# EAGLE design EnclosureBoard (EAGLE 9.2.2)
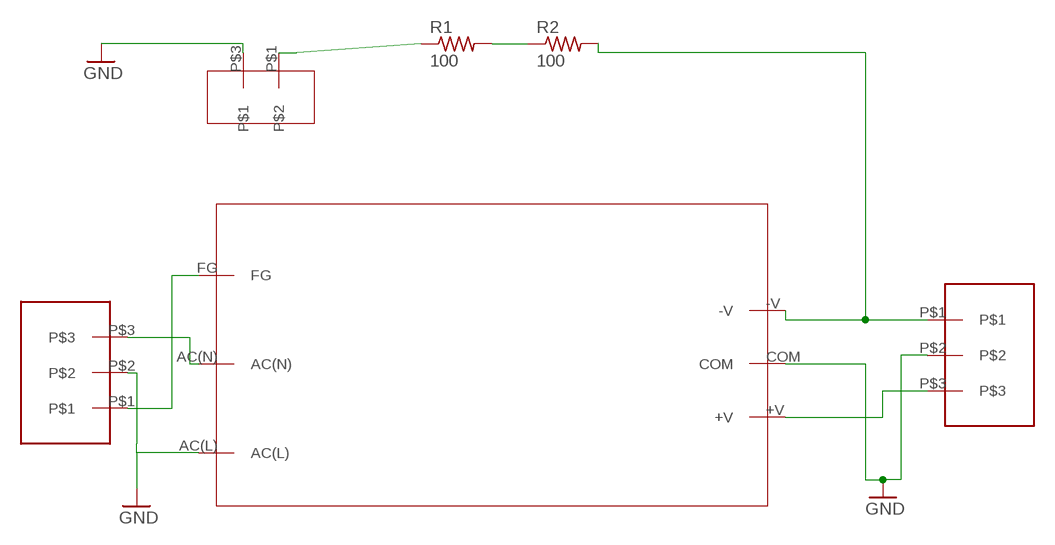
[diagram p0: schematic, sheet 1]

## Parts
R1  100  R-US_0207/10  [0207/10]
R2  100  R-US_0207/10  [0207/10]
U$1  YW1512A-POWER-SUPPLY  [YW1512A]
U$2  AC-POWER-ENTRY  [3POSTERMINAL]
U$3  AC-POWER-ENTRY  [3POSTERMINAL]
U$4  2POSTBLOCK  [2POSTTERMINALBLOCK]

## Nets
GND: U$1.AC(L) U$1.COM U$2.P$2 U$3.P$2 U$4.P$3
N$1: R1.1 U$4.P$1
N$2: R1.2 R2.1
N$3: U$1.FG U$2.P$1
N$5: R2.2 U$1.-V U$3.P$1
N$6: U$1.AC(N) U$2.P$3
N$8: U$1.+V U$3.P$3

## Library data of the parts
R1 R2 = resistor:R-US_: RESISTOR, American symbol
U$1 = PowerSupply:YW1512A-POWER-SUPPLY
U$2 U$3 = Terminal Block:AC-POWER-ENTRY
U$4 = 2PostTerminalBlock:2POSTBLOCK

## Board
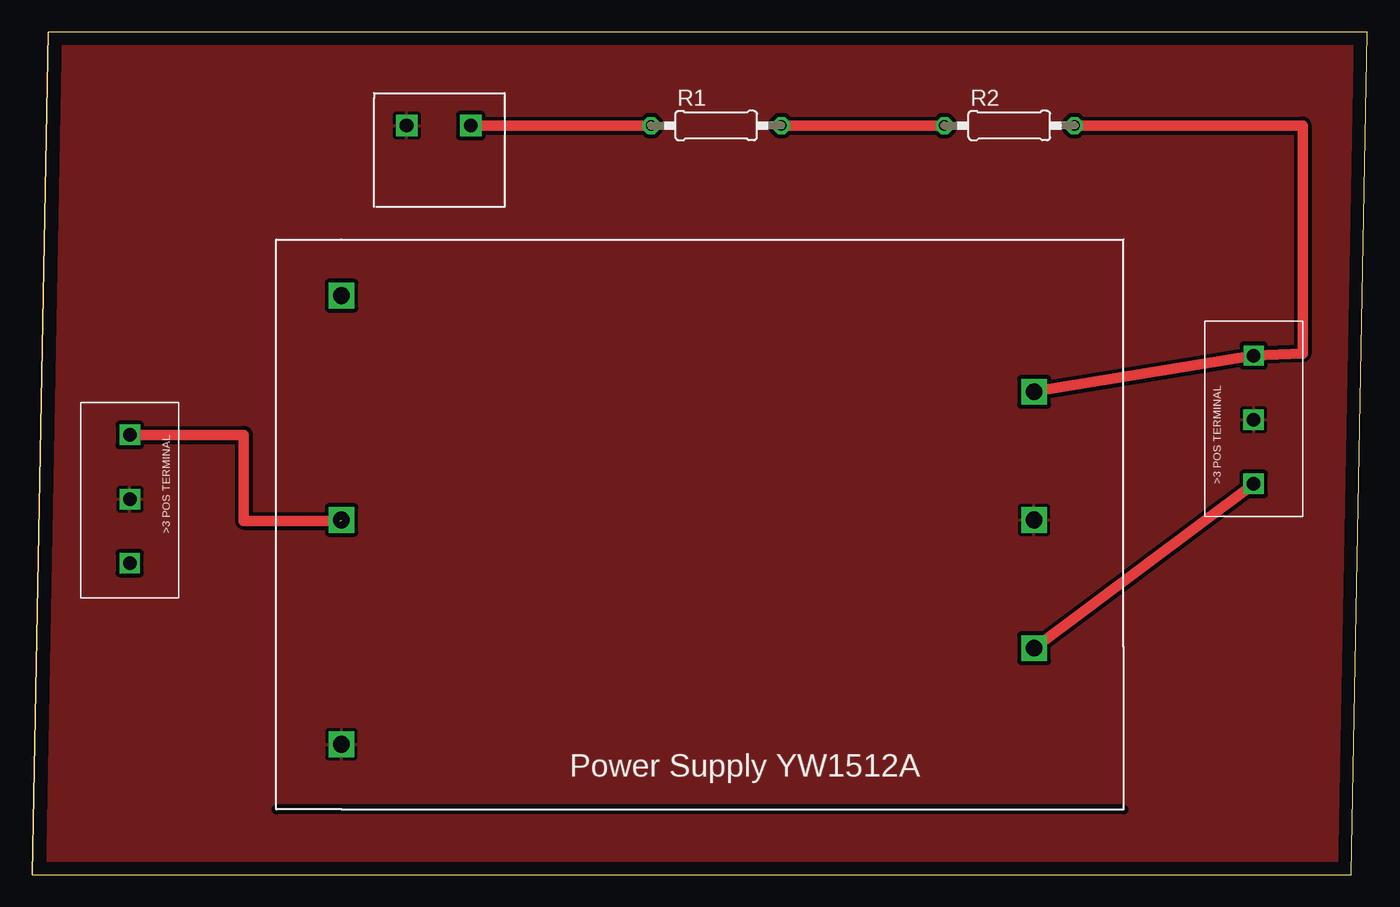
[diagram p1: board, top side]
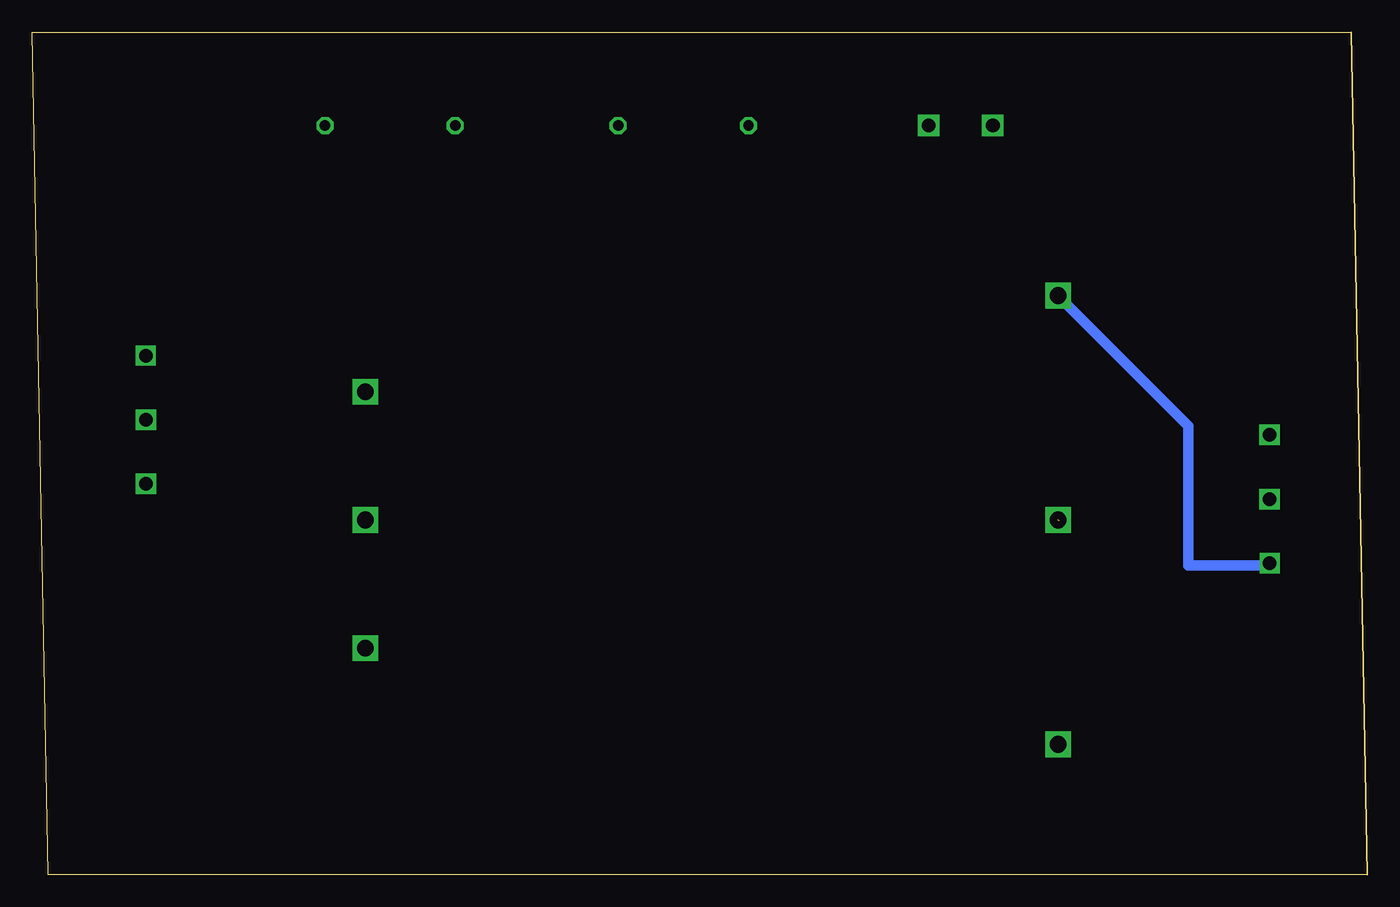
[diagram p2: board, bottom side, seen from below]

Size 104.12 x 65.71 mm. Coordinates in mm from the lower left corner, seen from the top.
Outline: 0,0 102.85,0 104.12,65.71 1.27,65.71 0,0
Copper layers (1*16): Top 0.035mm / dielectric 1.5mm / Bottom 0.035mm
Design rules "default": minimum track width 6mil, minimum drill 0.35mm, track to track 6mil, track to pad 6mil, pad to pad 6mil, via to via 6mil, smd to smd 6mil, copper to edge 40mil, drill to drill 6mil, minimum pad ring 10mil, minimum via ring 8mil, stop-mask expansion 4mil, vias tented up to drill 0mil, thermal gap 10mil
tRestrict: 1 lines

### Footprints (pad centres in the part's own frame; a part is rotated, then mirrored left to right if it is on the bottom)
0207/10 = drill 0.813 octagon: 1 -5.08,0; 2 5.08,0
YW1512A = drill 1.3 pad 2 square: +V 54,7.5; -V 54,27.5; AC(L) 0,0; AC(N) 0,17.5; COM 54,17.5; FG 0,35
3POSTERMINAL = drill 1.05 pad 1.5 square: P$1 0,10 | drill 1.05 pad 1.6 square: P$2 0,5; P$3 0,0
2POSTTERMINALBLOCK = drill 1.07 pad 1.676 square: P$1 6.35,2.62; P$3 6.35,7.62

### Placement (x,y rotation side)
R1  53.34,58.42 0 top
R2  76.2,58.42 0 top
U$1  24.13,10.16 0 top
U$2  7.62,34.29 180 top
U$3  95.25,30.48 0 top
U$4  36.83,52.07 90 top

### Tracks (layer width: path | path; a pad name or v marks a point on that pad's centre or on a via)
GND
  pour Top (isolate 0.305): 0,-1.27 0,67.31 104.14,67.31 104.14,-1.27
N$1
  Top 0.813: U$4.P$1 R1.1
N$2
  Top 0.813: R1.2 R2.1
N$3
  Bottom 0.152: 7.78,24.13 U$2.P$1
  Bottom 0.813: U$1.FG 13.97,35 13.97,24.13 7.78,24.13
N$5
  Top 0.813: U$1.-V U$3.P$1 99.06,40.64 99.06,58.42 R2.2
N$6  (1 unrouted)
  Top 0.813: 24.03,27.58 16.51,27.58 16.51,30.48 16.51,31.75 16.51,34.29 U$2.P$3
N$8
  Top 0.813: U$3.P$3 U$1.+V